# EAGLE design AF_mshield-v11 (EAGLE 4.13)
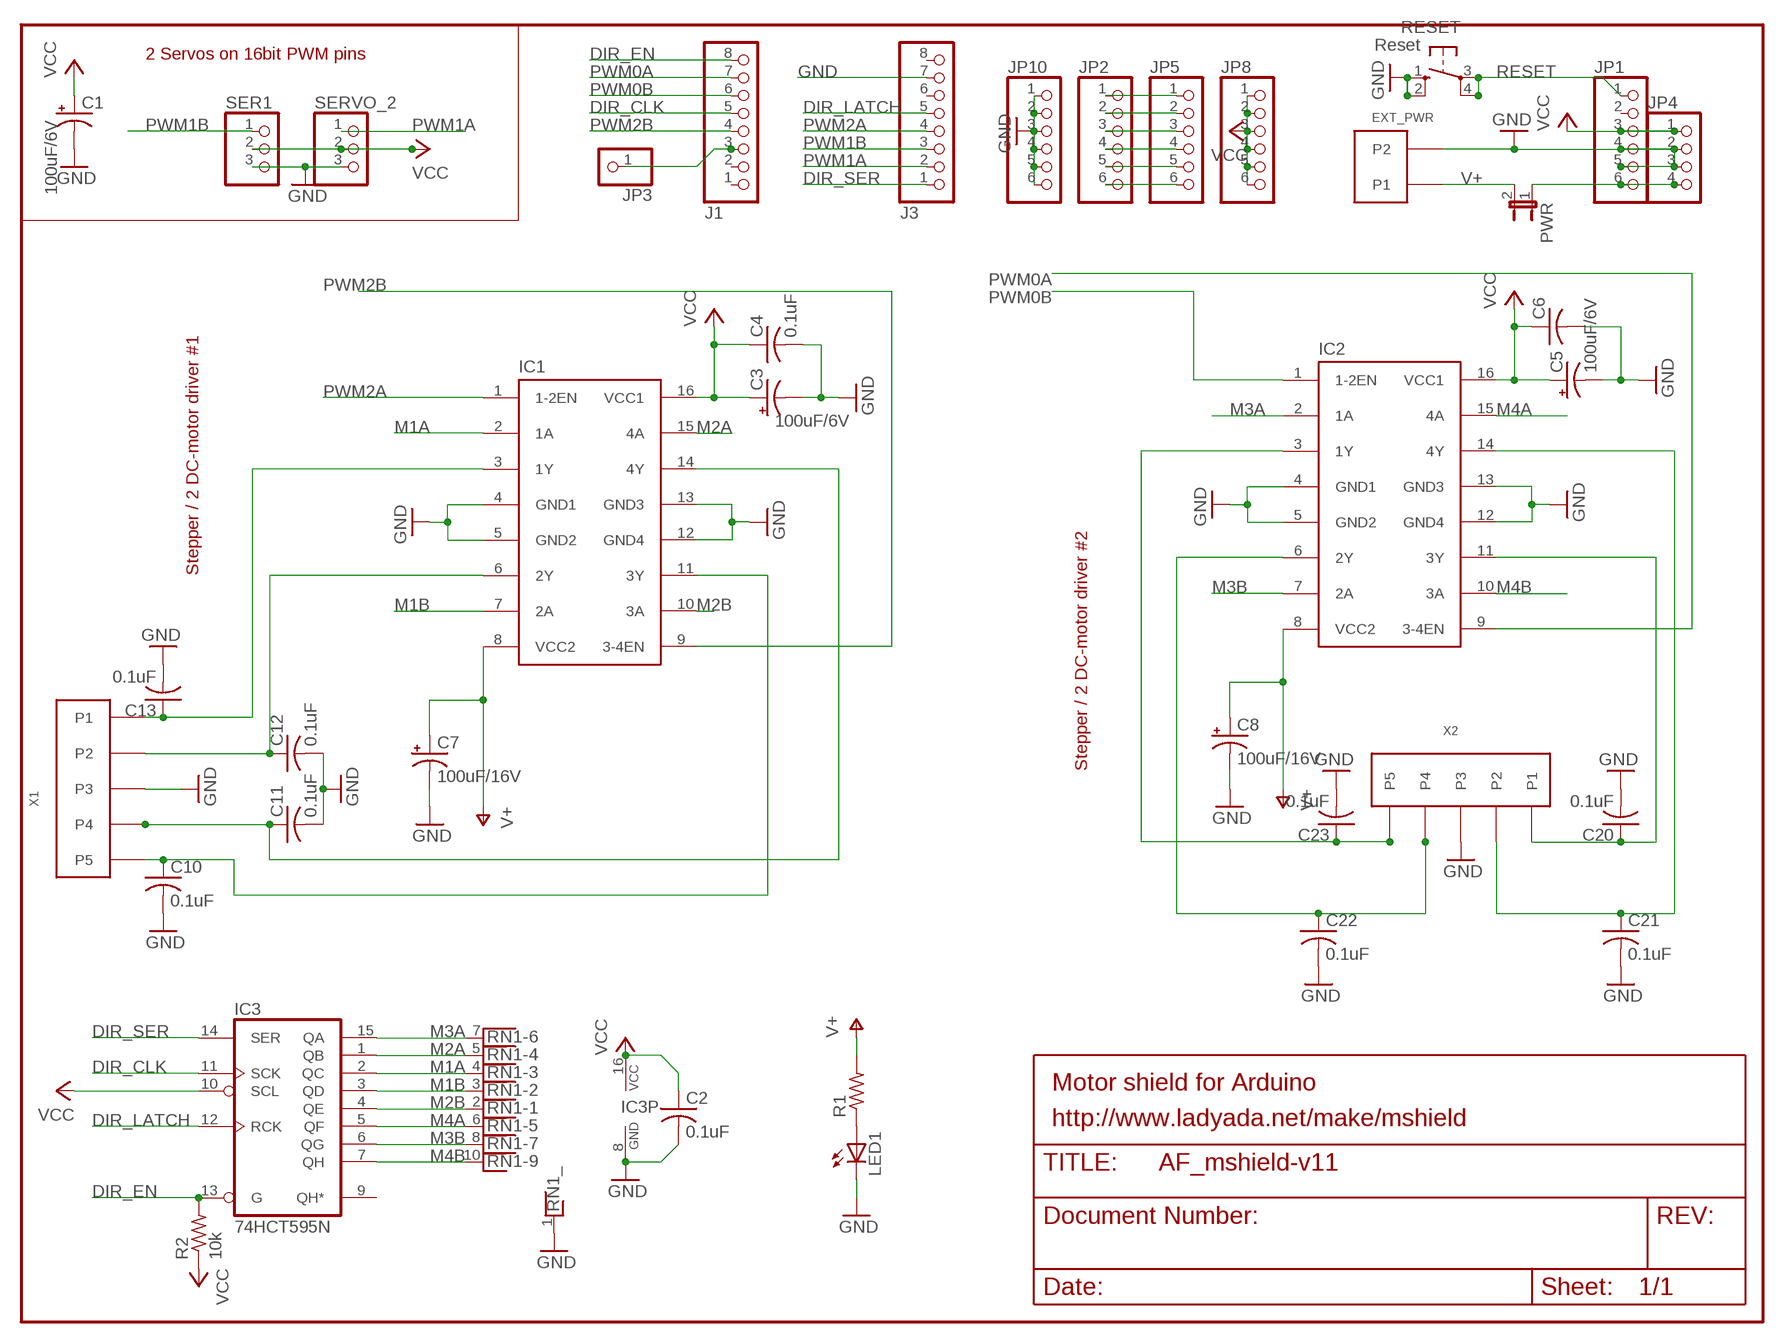
[diagram p0: schematic, sheet 1]

## Parts
C1  100uF/6V  CPOL-USE2.5-5  [E2,5-5]
C2  0.1uF  C-US025-025X050  [C025-025X050]
C3  100uF/6V  CPOL-USE2.5-5  [E2,5-5]
C4  0.1uF  C-US025-025X050  [C025-025X050]
C5  100uF/6V  CPOL-USE2.5-5  [E2,5-5]
C6  C-US025-025X050  [C025-025X050]
C7  100uF/16V  CPOL-USE2.5-6  [E2,5-6]
C8  100uF/16V  CPOL-USE2.5-6  [E2,5-6]
C10  0.1uF  C-US025-025X050  [C025-025X050]
C11  0.1uF  C-US025-025X050  [C025-025X050]
C12  0.1uF  C-US025-025X050  [C025-025X050]
C13  0.1uF  C-US025-025X050  [C025-025X050]
C20  0.1uF  C-US025-025X050  [C025-025X050]
C21  0.1uF  C-US025-025X050  [C025-025X050]
C22  0.1uF  C-US025-025X050  [C025-025X050]
C23  0.1uF  C-US025-025X050  [C025-025X050]
EXT_PWR  PINHEAD  [TERMBLOCK508]
IC1  L293E  [DIL16]
IC2  L293E  [DIL16]
IC3  74HCT595N  [DIL16]
J1  PINHD-1X8  [1X08]
J3  PINHD-1X8  [1X08]
JP1  PINHD-1X6  [1X06]
JP2  PINHD-1X6  [1X06]
JP3  PINHD-1X1  [1X01]
JP4  PINHD-1X4  [1X04]
JP5  PINHD-1X6B  [1X06-BIG]
JP8  PINHD-1X6B  [1X06-BIG]
JP10  PINHD-1X6B  [1X06-BIG]
LED1  LED3MM  [LED3MM]
PWR  JP1E  [JP1]
R1  R-US_0207/10  [0207/10]
R2  10k  R-US_0207/10  [0207/10]
RESET  Reset  10-XX  [B3F-10XX]
RN1  RNX9  [RN-10]
SER1  PINHD-1X3  [1X03]
SERVO_2  PINHD-1X3  [1X03]
X1  TERM5  [TERM1X5]
X2  TERM5  [TERM1X5]

## Nets
9V: JP1.6 JP4.4 PWR.1
DIR_CLK: IC3.11(SCK) J1.5
DIR_EN: IC3.13(G) J1.8 R2.2
DIR_LATCH: IC3.12(RCK) J3.5
DIR_SER: IC3.14(SER) J3.1
GND [power]: C1.- C2.2 C3.- C4.2 C5.- C6.2 C7.- C8.- C10.2 C11.2 C12.2 C13.2 C20.2 C21.2 C22.2 C23.2 EXT_PWR.P$4(P2) IC1.4(GND1) IC1.5(GND2) IC1.12(GND4) IC1.13(GND3) IC2.4(GND1) IC2.5(GND2) IC2.12(GND4) IC2.13(GND3) IC3.8(GND) J3.7 JP1.4 JP1.5 JP4.2 JP4.3 JP10.1 JP10.2 JP10.3 JP10.4 JP10.5 JP10.6 LED1.K(C) RESET.1(S) RESET.2(S1) RN1.1 SER1.3 SERVO_2.3 X1.P3 X2.P3
M1A: IC1.2(1A) IC3.2(QC) RN1.4
M1B: IC1.7(2A) IC3.3(QD) RN1.3
M2A: IC1.15(4A) IC3.1(QB) RN1.5
M2B: IC1.10(3A) IC3.4(QE) RN1.2
M3A: IC2.2(1A) IC3.15(QA) RN1.7
M3B: IC2.7(2A) IC3.6(QG) RN1.8
M4A: IC2.15(4A) IC3.5(QF) RN1.6
M4B: IC2.10(3A) IC3.7(QH) RN1.10
N$1: C13.1 IC1.3(1Y) X1.P1
N$2: JP2.1 JP5.1
N$3: JP2.2 JP5.2
N$4: JP2.3 JP5.3
N$5: JP2.4 JP5.4
N$6: JP2.5 JP5.5
N$7: C23.1 IC2.3(1Y) X2.P5
N$8: C22.1 IC2.6(2Y) X2.P4
N$9: C20.1 IC2.11(3Y) X2.P1
N$10: J1.3 JP3.1
N$13: JP2.6 JP5.6
N$20: C21.1 IC2.14(4Y) X2.P2
N$31: C12.1 IC1.6(2Y) X1.P2
N$32: C10.1 IC1.11(3Y) X1.P5
N$33: C11.1 IC1.14(4Y) X1.P4
N$35: LED1.A R1.1
PWM0A: IC2.9(3-4EN) J1.7
PWM0B: IC2.1(1-2EN) J1.6
PWM1A: J3.2 SERVO_2.1
PWM1B: J3.3 SER1.1
PWM2A: IC1.1(1-2EN) J3.4
PWM2B: IC1.9(3-4EN) J1.4
RESET: JP1.1 RESET.3(P) RESET.4(P1)
V+: C7.+ C8.+ EXT_PWR.P$3(P1) IC1.8(VCC2) IC2.8(VCC2) PWR.2 R1.2
VCC: C1.+ C2.1 C3.+ C4.1 C5.+ C6.1 IC1.16(VCC1) IC2.16(VCC1) IC3.10(SCL) IC3.16(VCC) JP1.3 JP4.1 JP8.1 JP8.2 JP8.3 JP8.4 JP8.5 JP8.6 R2.1 SER1.2 SERVO_2.2
Unconnected: IC3.9(QH*) J1.1 J1.2 J3.6 J3.8 JP1.2 RN1.9

## Notes on the sheet
- 2 Servos on 16bit PWM pins
- Stepper / 2 DC-motor driver #1
- Stepper / 2 DC-motor driver #2
- Motor shield for Arduino
- http://www.ladyada.net/make/mshield

## Library data of the parts
C1 C3 C5 C7 C8 = rcl-ez:CPOL-US: POLARIZED CAPACITOR, American symbol
C2 C4 C6 C10-C13 C20-C23 = rcl-ez:C-US: CAPACITOR, American symbol
EXT_PWR = mshield:PINHEAD
IC1 IC2 = texas:L293E: TI DEVICE
IC3 = 74xx-eu:74*595: 8-bit SHIFT REGISTER, output latch
J1 J3 = pinhead:PINHD-1X8: PIN HEADER
JP1 JP2 = pinhead:PINHD-1X6: PIN HEADER
JP3 = digg:PINHD-1X1: PIN HEADER
JP4 = pinhead:PINHD-1X4: PIN HEADER
JP5 JP8 JP10 = carduino:PINHD-1X6: PIN HEADER
LED1 = minimidi:LED: LED OSRAM: - CHIPLED LG R971, LG N971, LY N971, LG Q971, LY Q971, LO R971, LY R971 LH N974, LH R974 LS Q976, LO Q976, LY Q976 LO Q996 - Hyper CHIPLED LW Q18S LB Q993, LB Q99A, LB R99A - SideLED LS A670, LO A670, LY A670, LG A670, LP A670 LB A673, LV A673, LT A673, LW A673 LH A674 LY A675 LS A676, LA A676, LO A676, LY A676, LW A676 LS A679, LY A679, LG A679 - Hyper Micro SIDELED® LS Y876, LA Y876, LO Y876, LY Y876 LT Y87S - SmartLED LW L88C, LW L88S LB L89C, LB L89S, LG L890 LS L89K, LO L89K, LY L89K LS L896, LA L896, LO L896, LY L896 - TOPLED LS T670, LO T670, LY T670, LG T670, LP T670 LSG T670, LSP T670, LSY T670, LOP T670, LYG T670 LG T671, LOG T671, LSG T671 LB T673, LV T673, LT T673, LW T673 LH T674 LS T676, LA T676, LO T676, LY T676, LB T676, LH T676, LSB T676, LW T676 LB T67C, LV T67C, LT T67C, LS T67K, LO T67K, LY T67K, LW E67C LS E67B, LA E67B, LO E67B, LY E67B, LB E67C, LV E67C, LT E67C LW T67C LS T679, LY T679, LG T679 LS T770, LO T770, LY T770, LG T770, LP T770 LB T773, LV T773, LT T773, LW T773 LH T774 LS E675, LA E675, LY E675, LS T675 LS T776, LA T776, LO T776, LY T776, LB T776 LHGB T686 LT T68C, LB T68C - Hyper Mini TOPLED® LB M676 - Mini TOPLED Santana® LG M470 LS M47K, LO M47K, LY M47K Source: http://www.osram.convergy.de/
PWR = jumper:JP1E: JUMPER
R1 R2 = rcl-ez:R-US_: RESISTOR, American symbol
RESET = switch-omron:10-XX: OMRON SWITCH
RN1 = resistor-net:RNX9: RESISTOR NETWORK
SER1 SERVO_2 = pinhead:PINHD-1X3: PIN HEADER
X1 X2 = mshield:TERM5

## Net classes
1 power: width 0.61 mm

## Board
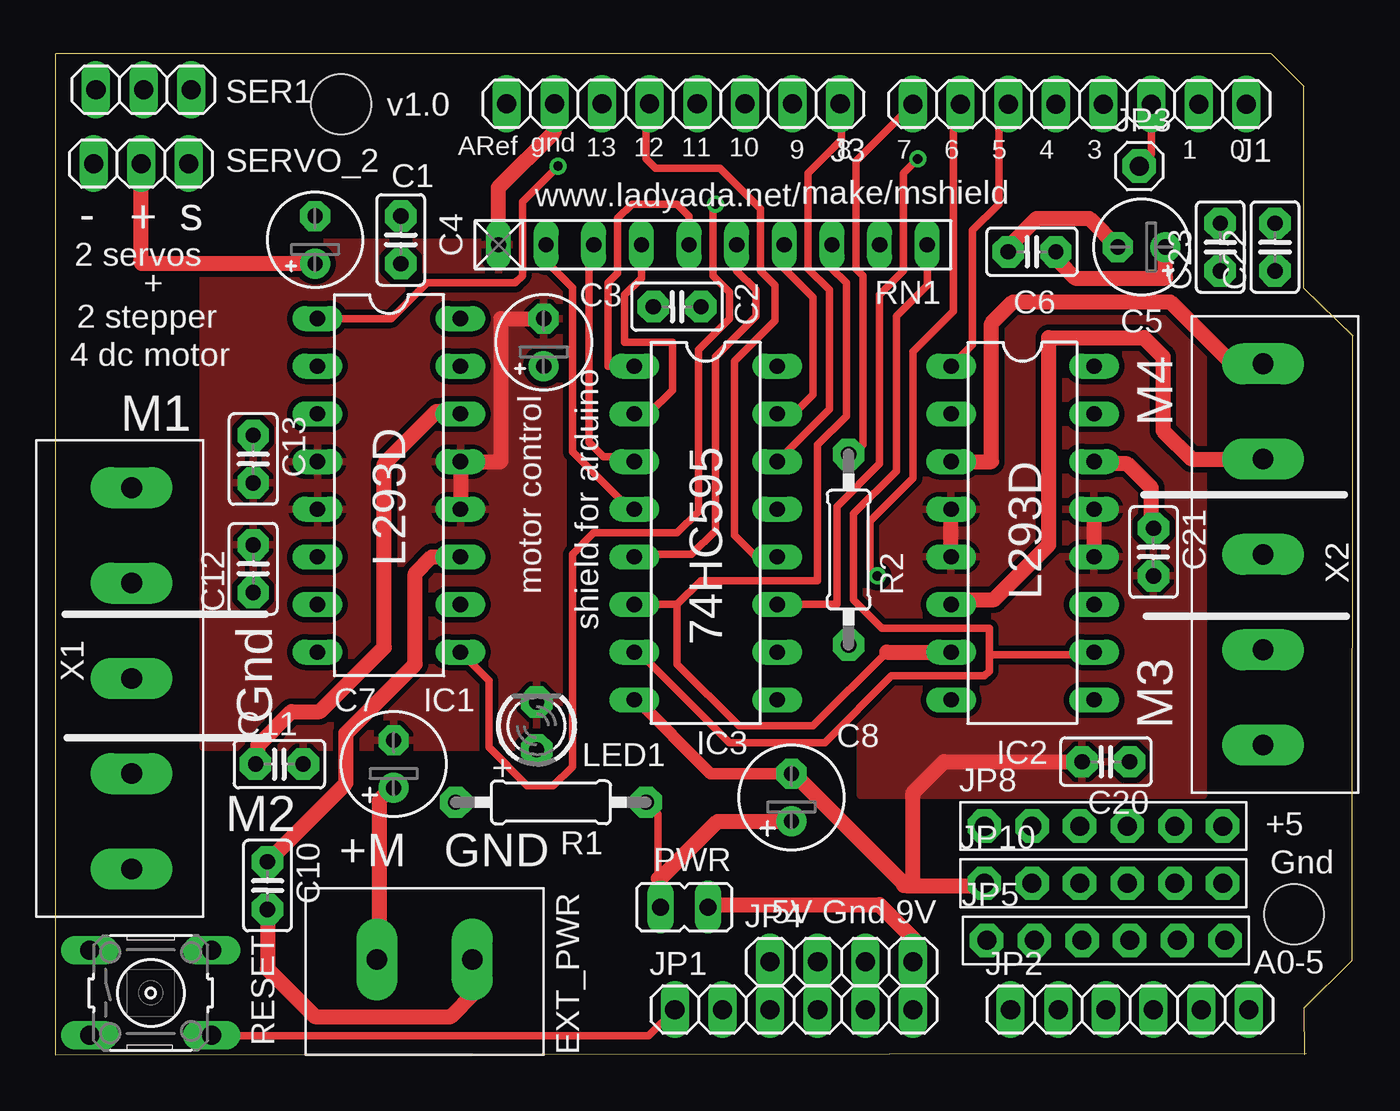
[diagram p1: board, top side]
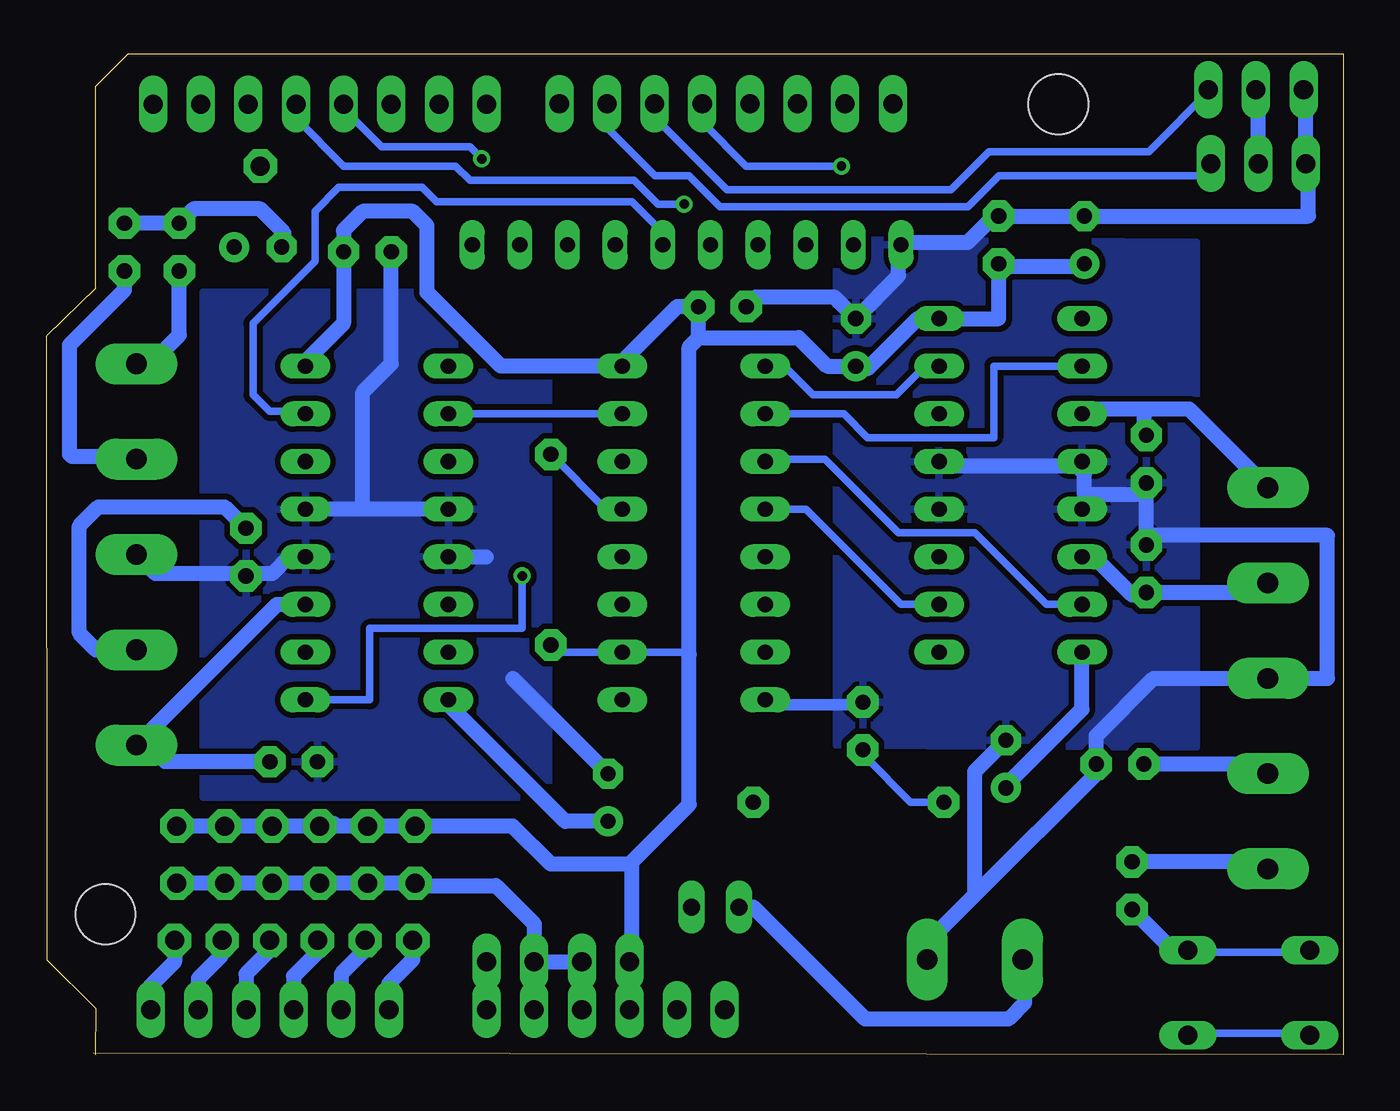
[diagram p2: board, bottom side, seen from below]

Size 69.16 x 53.35 mm. Coordinates in mm from the lower left corner, seen from the top.
Outline: 69.13,5.05 69.13,5.05
Outline: 69.13,5.05 69.16,38.33 66.55,40.87 66.55,51.63 64.83,53.35 0,53.35 0,0 66.68,0.09
Outline: 69.13,5.05 66.55,2.5 66.57,0
Copper layers (1*16): Top 0.035mm / dielectric 1.5mm / Bottom 0.035mm
Design rules "default": minimum track width 16mil, minimum drill 19mil, track to track 12mil, track to pad 12mil, pad to pad 12mil, via to via 12mil, smd to smd 0mil, copper to edge 10mil, drill to drill 8mil, minimum pad ring 10mil, minimum via ring 8mil, stop-mask expansion 4mil, vias tented up to drill 0mil, thermal gap 10mil
Holes 3.2 mm at 66.04,7.5 15.24,50.68

### Footprints (pad centres in the part's own frame; a part is rotated, then mirrored left to right if it is on the bottom)
E2,5-5 = drill 0.813 pad 1.6 round: + -1.27,0 | drill 0.813 pad 1.6 octagon: - 1.27,0
C025-025X050 = drill 0.813 pad 1.676 octagon: 1 -1.27,0; 2 1.27,0
E2,5-6 = drill 0.813 pad 1.6 round: + -1.27,0 | drill 0.813 pad 1.6 octagon: - 1.27,0
TERMBLOCK508 = drill 1.1 pad 2.184 long: P$3 -2.54,0; P$4 2.54,0
DIL16 = drill 0.813 long: 1 -8.89,-3.81; 2 -6.35,-3.81; 3 -3.81,-3.81; 4 -1.27,-3.81; 5 1.27,-3.81; 6 3.81,-3.81; 7 6.35,-3.81; 8 8.89,-3.81; 9 8.89,3.81; 10 6.35,3.81; 11 3.81,3.81; 12 1.27,3.81; 13 -1.27,3.81; 14 -3.81,3.81; 15 -6.35,3.81; 16 -8.89,3.81
1X08 = drill 1.016 long: 1 -8.89,0; 2 -6.35,0; 3 -3.81,0; 4 -1.27,0; 5 1.27,0; 6 3.81,0; 7 6.35,0; 8 8.89,0
1X06 = drill 1.016 long: 1 -6.35,0; 2 -3.81,0; 3 -1.27,0; 4 1.27,0; 5 3.81,0; 6 6.35,0
1X01 = drill 1.016 pad 1.778 octagon: 1 0,0
1X04 = drill 1.016 long: 1 -3.81,0; 2 -1.27,0; 3 1.27,0; 4 3.81,0
1X06-BIG = drill 1.016 pad 1.778 octagon: 1 -6.35,0; 2 -3.81,0; 3 -1.27,0; 4 1.27,0; 5 3.81,0; 6 6.35,0
LED3MM = drill 0.813 pad 1.676 octagon: A -1.27,0; K 1.27,0
JP1 = drill 0.914 long: 1 0,-1.27; 2 0,1.27
0207/10 = drill 0.813 pad 1.676 octagon: 1 -5.08,0; 2 5.08,0
B3F-10XX = drill 1.016 long: 1 -3.251,2.261; 2 3.251,2.261; 3 -3.251,-2.261; 4 3.251,-2.261
RN-10 = drill 0.813 long: 1 -11.43,0; 2 -8.89,0; 3 -6.35,0; 4 -3.81,0; 5 -1.27,0; 6 1.27,0; 7 3.81,0; 8 6.35,0; 9 8.89,0; 10 11.43,0
1X03 = drill 1.016 long: 1 -2.54,0; 2 0,0; 3 2.54,0
TERM1X5 = drill 1.1 pad 2.184 long: P1 -10.16,0; P2 -5.08,0; P3 0,0; P4 5.08,0; P5 10.16,0

### Placement (x,y rotation side)
C1  13.84,43.44 90 top
C2  33.14,39.88 180 top
C3  26.03,37.98 90 top
C4  18.41,43.44 90 top
C5  57.91,43.06 180 top
C6  52.07,42.8 180 top
C7  18.03,15.5 90 top
C8  39.24,13.72 90 top
C10  11.3,9.02 270 top
C11  11.93,15.5 0 top
C12  10.54,25.91 90 top
C13  10.54,31.76 270 top
C20  56,15.63 180 top
C21  58.54,26.8 270 top
C22  65.02,43.06 90 top
C23  62.1,43.06 90 top
EXT_PWR  19.68,5.09 0 top
IC1  17.78,30.36 270 top
IC2  51.56,27.82 270 top
IC3  34.67,27.82 270 top
J1  54.61,50.68 180 top
J3  32.95,50.7 180 top
JP1  39.37,2.42 0 top
JP2  57.27,2.42 0 top
JP3  57.78,47.38 0 top
JP4  41.91,4.96 0 top
JP5  56,6.1 0 top
JP8  55.88,12.2 0 top
JP10  55.88,9.15 0 top
LED1  25.65,17.53 90 top
PWR  33.52,7.88 90 top
R1  26.41,13.47 0 top
R2  42.29,26.93 90 top
RESET  5.08,3.31 0 top
RN1  35.05,43.19 0 top
SER1  4.7,51.44 180 top
SERVO_2  4.57,47.5 180 top
X1  4.06,20.07 270 top
X2  64.39,26.68 90 top

### Tracks (layer width: path | path; a pad name or v marks a point on that pad's centre or on a via)
9V
  Top 0.813: PWR.1 34.79,8.01 | 34.79,8.01 43.94,8.01 45.72,6.23 JP4.4 | 34.79,8.01 34.67,8.13
  Bottom 0.813: JP1.6 45.72,4.2 45.59,4.32 45.72,4.45 JP4.4
DIR_CLK  (via drill 0.5)
  Top 0.406: IC3.11 41.65,24.01 41.65,29.22 43.94,31.5 43.94,40.52 45.21,41.79 45.21,47 v45.97,47.76
  Bottom 0.406: v45.97,47.76 46.61,48.39 51.3,48.39 53.34,50.42 J1.5
DIR_EN
  Top 0.406: R2.2 42.54,32.01 43.05,32.52 43.05,41.53 42.67,41.92 42.67,47.63 J1.8
  Bottom 0.406: IC3.13 39.37,29.09 R2.2
DIR_LATCH
  Top 0.406: 38.6,26.55 IC3.12 37.33,26.55 36.19,27.69 36.19,36.96 38.35,39.12 38.35,41.03 37.59,41.79 37.59,45.09 35.43,47.25 32,47.25 31.49,47.76 31.49,50.55 31.53,50.55 J3.5
DIR_SER
  Top 0.406: IC3.14 41.27,34.42 41.27,40.77 40.13,41.92 40.13,47 41.91,48.77 41.91,50.68 41.84,50.75 | 41.84,50.75 41.78,50.81 | 41.84,50.75 J3.1
GND
  Top 0.406: EXT_PWR.P$4 22.22,5.72
  Top 0.61: 31.11,18.67 IC3.8 30.86,19.06 34.92,14.99 C8.-
  Top 0.813: C6.2 50.8,43.06 52.32,44.58 55.11,44.58 C5.- | 21.71,31.63 23.75,31.63 23.75,39.25 C3.- | 26.41,39.38 25.9,39.38 C3.- | C8.- 39.37,14.99 45.34,9.02 | 45.34,9.02 45.72,9.02 | 45.72,9.02 49.15,9.02 | 49.15,9.02 49.53,9.02 JP10.1 49.4,9.02 49.15,9.02 | IC2.5 IC2.4 | IC1.13 21.71,31.63 | IC1.12 21.59,31.5 21.71,31.63 | J3.7 26.6,49.21 23.62,46.23 RN1.1 | C3.- 26.16,39.25 | IC2.13 IC2.12 | C10.2 11.3,4.58 13.84,2.04 21.08,2.04 22.35,3.31 22.35,5.09 EXT_PWR.P$4 | C20.2 47.37,15.63 45.72,13.98 45.72,9.02 | 45.34,9.02 45.21,9.02
  Bottom 0.406: 8.35,5.59 8.25,5.59 8.25,5.57 RESET.2 8.23,5.47 1.77,5.47 1.77,5.57 | 1.77,5.57 1.77,5.59 | RESET.1 1.77,5.57
  Bottom 0.61: IC3.8 30.6,18.67 25.65,18.67 25.52,18.8 LED1.K
  Bottom 0.813: C2.2 31.37,40.39 27.17,40.39 C3.- 23.75,41.53 23.75,43.19 23.62,43.31 RN1.1 23.49,43.31 20.06,43.31 18.67,44.71 C4.2 C1.- 1.9,44.71 1.9,47.5 SERVO_2.3 2.03,51.19 2.16,51.19 SER1.3 | 14.22,31.37 IC1.4 | 14.22,31.37 21.46,31.37 21.46,31.5 IC1.13 | IC1.5 13.84,29.22 13.84,29.85 | 14.22,31.37 13.84,30.99 13.84,29.85 | 22.22,5.72 EXT_PWR.P$4 22.09,5.59 22.09,6.1 19.43,8.77 | C8.- 44.32,20.07 | IC2.5 45.72,26.55 | IC2.12 56.26,26.55 57.15,25.66 58.42,25.66 C21.2 58.67,25.66 63.37,25.66 X2.P3 | JP10.6 JP10.5 57.27,9.15 57.15,9.02 JP10.4 JP10.3 | JP10.3 54.35,9.15 | JP10.2 51.81,9.15 | JP10.2 JP10.3 | JP10.1 JP10.2 | JP4.3 JP1.5 | JP1.4 JP4.2 40.76,5.09 40.89,4.96 JP4.3 | JP4.3 43.18,6.99 45.21,9.02 49.4,9.02 JP10.1 | JP10.1 49.4,9.15 | IC2.4 52.32,29.09 | 52.32,29.09 IC2.13 | C6.2 50.8,36.84 52.32,35.31 52.32,29.09 | 10.54,29.85 13.84,29.85 | 10.54,29.85 C12.2 10.41,27.18 10.41,27.69 0.89,27.69 0.89,20.07 10.16,20.07 | 10.54,29.85 C13.2 | 10.16,20.07 X1.P3 | 10.16,20.07 13.2,17.02 C11.2 13.2,14.99 19.43,8.77 | C10.2 9.14,5.59 8.35,5.59 | 19.43,8.77 19.68,8.77 19.68,15.12 C7.- | C22.2 C23.2 61.34,45.09 57.78,45.09 56.51,43.82 56.51,43.19 C5.-
  pour Bottom: 42.41,40.65 60.83,40.65 60.83,13.72 42.41,13.72
  pour Bottom: 7.87,43.31 27.05,43.44 27.05,16.52 7.87,16.39
  pour Top: 7.87,43.31 27.05,43.31 27.05,16.39 7.87,16.39
  pour Top: 42.92,40.77 61.21,40.77 61.21,13.85 42.92,13.85
M1A
  Top 0.406: IC3.2 31.62,34.17 32.89,35.44 32.89,37.98 30.35,37.98 30.35,40.52 31.24,41.41 RN1.4
  Bottom 0.406: IC3.2 26.67,34.17 25.4,32.9 18.67,32.9 18.67,36.71 IC1.2
M1B
  Top 0.406: RN1.3 28.7,42.42 28.44,42.17 28.44,32.64 29.21,31.88 30.73,31.88 30.86,31.76 IC3.3
  Bottom 0.406: IC1.7 15.87,24.01 19.68,27.82 23.75,27.82 27.68,31.76 30.86,31.76 IC3.3
M2A
  Top 0.406: IC3.1 29.46,36.71 29.46,41.15 29.97,41.66 29.97,44.58 30.73,45.34 33.14,45.34 33.78,44.71 RN1.5
  Bottom 0.406: IC3.1 29.84,36.71 28.32,35.18 23.87,35.18 22.48,36.58 21.21,36.58 21.33,36.71 IC1.15
M2B
  Top 0.406: RN1.2 26.16,42.3 27.56,40.9 27.56,32.14 30.86,28.83 IC3.4
  Bottom 0.406: IC1.10 23.62,24.01 28.7,29.09 IC3.4
M3A
  Top 0.406: RN1.7 38.86,41.92 40.38,40.39 40.38,35.18 39.37,34.17 38.6,34.17 | IC3.15 38.6,34.17 | 38.6,34.17 38.22,34.17
  Bottom 0.406: IC3.15 IC2.2
M3B
  Top 0.406: 44.32,21.47 40.38,17.53 36.45,17.53 33.14,20.83 33.14,24.01 | 30.6,24.01 IC3.6 33.14,24.01 | 33.14,24.01 34.41,25.28 40.64,25.28 40.64,32.52 42.16,34.04 42.16,41.15 41.4,41.92 RN1.8
  Top 0.813: 47.88,21.47 IC2.7 | 44.32,21.47 47.88,21.47 | 47.88,21.47 47.88,21.6
M4A
  Top 0.406: IC3.5 30.98,26.68 33.91,26.68 35.18,27.95 35.18,37.22 37.33,39.38 37.33,40.77 36.32,41.79 RN1.6
  Bottom 0.406: IC2.15 55.37,34.3 57.27,34.3 58.16,35.18 58.16,38.99 54.86,42.3 54.86,44.96 53.59,46.23 49.15,46.23 48.38,45.47 37.97,45.47 36.45,43.95 36.45,43.19 RN1.6
M4B
  Top 0.406: IC3.7 31.11,21.47 35.94,16.64 41.02,16.64 44.57,20.2 49.53,20.2 49.78,20.45 49.78,21.47 | IC2.10 55.37,21.34 49.78,21.34 49.78,21.47 | RN1.10 46.48,41.03 44.83,39.38 44.83,31.12 42.54,28.83 42.54,24.26 44.07,22.74 49.78,22.74 49.78,21.47
N$1
  Bottom 0.813: IC1.3 13.84,34.3 13.84,34.42 10.66,34.42 | X1.P1 8.25,34.42 10.66,34.42 | C13.1 10.66,33.15 10.66,34.42
N$2
  Bottom 0.813: JP5.1 49.65,5.09 50.92,3.82 JP2.1 50.8,2.42
N$3
  Bottom 0.813: JP5.2 52.32,6.1 52.19,5.97 52.19,5.59 53.46,4.32 JP2.2
N$4
  Bottom 0.813: JP2.3 56,4.2 54.73,5.47 JP5.3
N$5
  Bottom 0.813: 57.4,5.85 57.27,5.97 JP5.4 57.27,5.85 57.15,5.72 58.54,4.32 JP2.4
N$6
  Bottom 0.813: JP5.5 59.69,6.1 59.81,5.97 59.81,5.34 61.08,4.07 JP2.5
N$7
  Top 0.813: IC2.3 49.91,31.63 49.91,38.99 51.05,40.14 59.43,40.14 62.73,36.84 X2.P5
  Bottom 0.813: X2.P5 63.62,36.84 62.1,38.36 C23.1
N$8
  Top 0.813: X2.P4 60.58,31.76 59.05,33.28 59.05,37.22 58.04,38.23 52.96,38.23 52.96,27.18 50.03,24.26 47.75,24.26 IC2.6
  Bottom 0.813: C22.1 65.02,40.77 67.94,37.85 67.94,32.01 67.81,31.88 64.26,31.88 64.13,31.76 X2.P4
N$9
  Bottom 0.813: IC2.11 56.89,24.01 X2.P1 64.13,16.52 64,16.64 63.88,16.64 62.86,15.63 C20.1
N$10
  Top 0.406: JP3.1 58.42,48.01 J1.3
N$13
  Bottom 0.813: JP5.6 62.48,6.1 62.35,5.97 62.35,4.96 63.62,3.69 JP2.6
N$20
  Top 0.813: IC2.14 55.37,31.5 57.15,31.5 58.42,30.23 58.42,27.95 C21.1
  Bottom 0.813: C21.1 59.69,29.22 66.42,29.22 67.43,28.2 67.43,22.48 66.54,21.6 X2.P2
N$31
  Bottom 0.813: IC1.6 13.84,26.42 13.2,26.42 11.3,24.52 10.79,24.52 10.66,24.64 C12.1 5.33,24.64 4.82,25.15 X1.P2
N$32
  Top 0.813: C10.1 15.49,14.48 15.49,17.15 19.17,20.83 19.17,25.66 20.06,26.55 IC1.11
  Bottom 0.813: X1.P5 4.06,10.29 C10.1
N$33
  Top 0.813: IC1.14 21.59,34.3 20.32,34.3 17.52,31.5 17.52,21.72 14.09,18.29 12.57,18.29 10.79,16.52 10.79,15.63 | 10.79,15.63 10.66,15.63 C11.1 10.79,15.63
  Bottom 0.813: C11.1 4.57,15.5 X1.P4
N$35
  Bottom 0.406: R1.1 23.11,13.47 25.52,15.88
  Bottom 0.813: 25.65,16.39 LED1.A 25.65,15.88 25.52,15.88
PWM0A  (via drill 0.5)
  Top 0.406: J1.7 47.88,50.3 47.88,39.63 45.72,37.47 45.72,30.74 43.43,28.45 43.43,25.91 v43.81,25.53
  Bottom 0.406: IC2.9 51.94,18.93 51.94,22.74 43.81,22.74 v43.81,25.53
PWM0B
  Top 0.406: IC2.1 48.89,37.85 48.89,43.95 50.29,45.34 50.29,50.68 J1.6
PWM1A
  Bottom 0.406: SERVO_2.1 6.98,47.5 7.62,46.87 18.41,46.87 20.06,45.22 33.27,45.22 34.92,46.87 36.74,46.87 39.37,49.5 39.37,50.77 | 39.37,50.77 39.37,50.81 | 39.37,50.77 J3.2
PWM1B
  Bottom 0.406: J3.3 36.76,49.97 32.89,46.11 20.95,46.11 18.92,48.14 10.41,48.14 6.98,51.57 7.11,51.57 SER1.1
PWM2A  (via drill 0.5)
  Top 0.406: IC1.1 17.9,39.25 19.81,41.15 24.51,41.15 24.89,41.53 24.89,45.47 v26.79,47.38 | J3.4 34.2,50.68
  Bottom 0.406: v26.79,47.38 31.87,47.38 34.16,49.66 34.16,50.42 34.22,50.48 J3.4
PWM2B  (via drill 0.5)
  Top 0.406: IC1.9 23.11,19.94 23.11,16.39 25.14,14.36 26.54,14.36 27.56,15.37 27.56,26.68 28.7,27.82 33.14,27.82 34.29,28.96 34.29,37.6 35.94,39.25 35.94,40.65 35.05,41.53 35.05,45.47 35.18,45.47 v35.18,45.34
  Bottom 0.406: 55.62,50.68 J1.4 55.88,49.92 53.34,47.38 47.37,47.38 46.61,46.61 37.84,46.61 36.57,45.34 v35.18,45.34
RESET
  Top 0.406: RESET.4 8.35,1.02 31.62,1.02 JP1.1
  Bottom 0.406: RESET.4 8.23,1.15 1.77,1.15 1.77,1.05 | 1.77,1.05 1.77,1.02 | RESET.3 1.77,1.05
V+
  Top 0.406: PWR.2 32.13,8.01 32.13,9.4 32.13,12.83 R1.2
  Top 0.813: 32.13,9.4 32.25,9.4 35.3,12.45 C8.+ | EXT_PWR.P$3 17.27,5.09 17.27,13.59 17.9,14.23 C7.+
  Bottom 0.813: IC1.8 13.97,18.42 17.78,14.61 17.78,14.48 C7.+ | EXT_PWR.P$3 17.01,5.47 | 17.01,5.47 16.63,5.85 | 17.01,5.47 17.01,5.34 | EXT_PWR.P$3 17.01,5.59 17.01,2.8 17.9,1.91 25.52,1.91 31.49,7.88 PWR.2 32.25,8.13 32.13,8.26 32.25,8.39 | IC2.8 48,18.93 41.53,12.45 C8.+ | EXT_PWR.P$3 17.27,5.47
VCC
  Top 0.813: 53.46,42.93 C6.1 53.46,42.68 53.46,42.3 54.35,41.41 59.18,41.41 C5.+ | C1.+ 4.57,42.17 SERVO_2.2
  Bottom 0.406: R2.1 42.16,21.85 42.16,21.47 IC3.10 34.79,21.47 34.79,21.34 34.92,21.34
  Bottom 0.813: IC1.16 21.46,39.12 21.33,39.25 | IC1.16 22.73,39.25 25.4,36.58 26.41,36.58 26.54,36.71 C3.+ 27.56,36.71 29.08,38.23 34.41,38.23 | 34.41,38.23 C2.1 35.56,39.88 38.6,36.84 IC3.16 38.48,36.84 38.6,36.71 44.95,36.71 48.89,40.65 48.89,44.2 49.65,44.96 52.32,44.96 53.34,43.95 C6.1 53.34,38.99 55.62,36.71 IC2.16 | 54.61,12.32 JP8.3 JP8.4 | 54.61,12.32 54.48,12.2 JP8.2 51.94,12.07 51.81,12.2 JP8.1 44.32,12.2 42.29,10.17 37.97,10.17 | JP8.4 57.53,12.2 | JP8.4 JP8.5 JP8.6 62.35,12.2 | JP1.3 JP4.1 | JP1.3 38.1,2.04 38.22,1.91 38.22,2.67 38.1,2.55 JP1.3 | JP4.1 38.1,5.97 | 54.61,12.32 53.84,12.32 | JP4.1 37.97,4.96 37.97,10.17 | 37.97,10.17 37.97,10.29 34.92,13.34 34.92,21.34 34.92,37.72 34.41,38.23 | 18.41,42.04 C4.1 | C1.+ 13.84,42.04 18.41,42.04 | 18.41,42.04 18.41,39.25 IC1.16 | SER1.2 4.7,51.31 4.57,51.31 SERVO_2.2

### Text on the board
tPlace: v1.0 | ARef | gnd | 13 | 12 | 11 | 10 | 9 | 8 | 7 | 6 | 5 | 4 | 3 | 1 | 0 | www.ladyada.net/ | make/mshield | - | + | s | 2 servos | + | 2 stepper | 4 dc motor | shield for arduino | motor control | M1 | M4 | L293D | L293D | 74HC595 | Gnd | M3 | + | M2 | +5 | +M | GND | Gnd | A0-5
tNames: 5V Gnd 9V